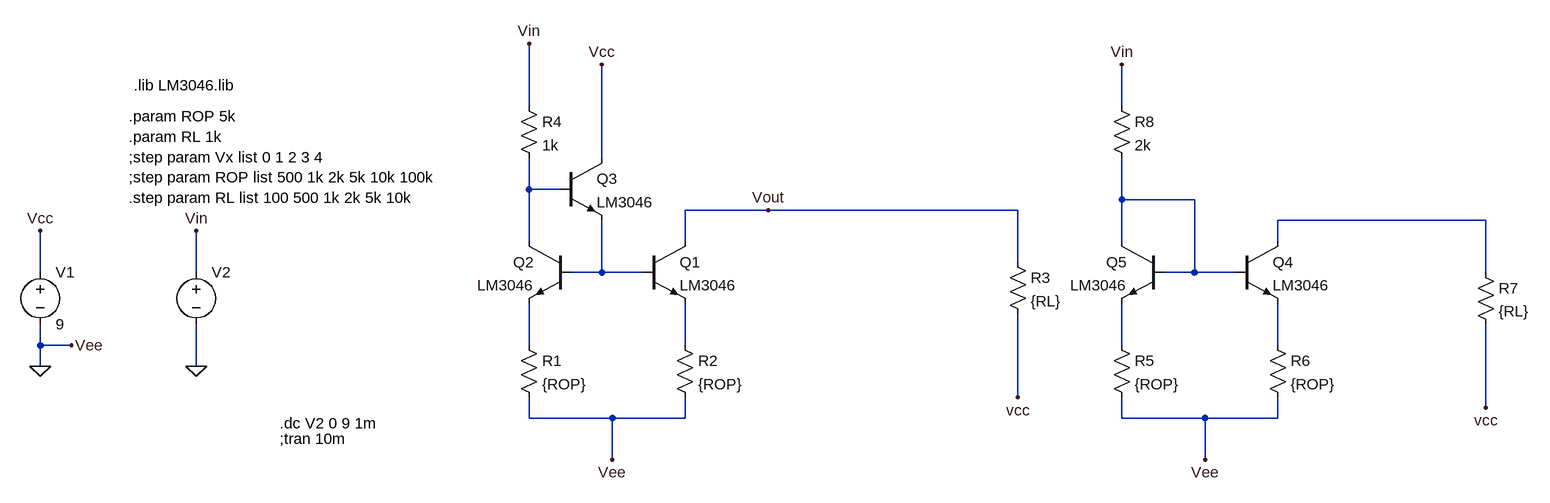
[diagram p0: schematic BJT_VoltageControlledCurrentSource1.asc]
BJT_VoltageControlledCurrentSource1.asc, the LTspice schematic file:
Version 4
SHEET 1 2172 680
WIRE 576 -288 576 -384
WIRE 1488 -288 1488 -352
WIRE 688 -208 688 -352
WIRE 576 -160 576 -208
WIRE 624 -160 576 -160
WIRE 1488 -144 1488 -208
WIRE 1600 -144 1488 -144
WIRE 944 -128 816 -128
WIRE 1328 -128 944 -128
WIRE 2048 -112 1728 -112
WIRE 576 -80 576 -160
WIRE 816 -80 816 -128
WIRE 1488 -80 1488 -144
WIRE 1728 -80 1728 -112
WIRE 1328 -48 1328 -128
WIRE -176 -32 -176 -96
WIRE 64 -32 64 -96
WIRE 688 -32 688 -112
WIRE 688 -32 640 -32
WIRE 752 -32 688 -32
WIRE 1600 -32 1600 -144
WIRE 1600 -32 1552 -32
WIRE 1664 -32 1600 -32
WIRE 2048 -32 2048 -112
WIRE -176 80 -176 48
WIRE -128 80 -176 80
WIRE 576 80 576 16
WIRE 816 80 816 16
WIRE 1488 80 1488 16
WIRE 1728 80 1728 16
WIRE -176 112 -176 80
WIRE 64 112 64 48
WIRE 1328 160 1328 32
WIRE 2048 176 2048 48
WIRE 576 192 576 160
WIRE 704 192 576 192
WIRE 816 192 816 160
WIRE 816 192 704 192
WIRE 1488 192 1488 160
WIRE 1616 192 1488 192
WIRE 1728 192 1728 160
WIRE 1728 192 1616 192
WIRE 704 256 704 192
WIRE 1616 256 1616 192
FLAG 688 -352 Vcc
FLAG 704 256 Vee
FLAG 576 -384 Vin
FLAG 944 -128 Vout
FLAG -176 112 0
FLAG 64 112 0
FLAG -176 -96 Vcc
FLAG 64 -96 Vin
FLAG -128 80 Vee
FLAG 1328 160 vcc
FLAG 1616 256 Vee
FLAG 2048 176 vcc
FLAG 1488 -352 Vin
SYMBOL npn 752 -80 R0
SYMATTR InstName Q1
SYMATTR Value LM3046
SYMBOL npn 640 -80 M0
SYMATTR InstName Q2
SYMATTR Value LM3046
SYMBOL npn 624 -208 R0
SYMATTR InstName Q3
SYMATTR Value LM3046
SYMBOL res 560 64 R0
SYMATTR InstName R1
SYMATTR Value {ROP}
SYMBOL res 800 64 R0
SYMATTR InstName R2
SYMATTR Value {ROP}
SYMBOL voltage -176 -48 R0
WINDOW 123 0 0 Left 2
WINDOW 39 0 0 Left 2
SYMATTR InstName V1
SYMATTR Value 9
SYMBOL voltage 64 -48 R0
WINDOW 123 0 0 Left 2
WINDOW 39 0 0 Left 2
SYMATTR InstName V2
SYMATTR Value ""
SYMBOL res 1312 -64 R0
SYMATTR InstName R3
SYMATTR Value {RL}
SYMBOL res 560 -304 R0
SYMATTR InstName R4
SYMATTR Value 1k
SYMBOL npn 1664 -80 R0
SYMATTR InstName Q4
SYMATTR Value LM3046
SYMBOL npn 1552 -80 M0
SYMATTR InstName Q5
SYMATTR Value LM3046
SYMBOL res 1472 64 R0
SYMATTR InstName R5
SYMATTR Value {ROP}
SYMBOL res 1712 64 R0
SYMATTR InstName R6
SYMATTR Value {ROP}
SYMBOL res 2032 -48 R0
SYMATTR InstName R7
SYMATTR Value {RL}
SYMBOL res 1472 -304 R0
SYMATTR InstName R8
SYMATTR Value 2k
TEXT -32 -320 Left 2 !.lib LM3046.lib
TEXT -40 -272 Left 2 !.param ROP 5k \n.param RL 1k\n;step param Vx list 0 1 2 3 4\n;step param ROP list 500 1k 2k 5k 10k 100k\n.step param RL list 100 500 1k 2k 5k 10k
TEXT 192 224 Left 2 !;tran 10m
TEXT 192 200 Left 2 !.dc V2 0 9 1m

The netlist it stands for:
* BJT_VoltageControlledCurrentSource1.asc
Q1 Vout N004 N006 0 LM3046
Q2 N001 N004 N005 0 LM3046
Q3 Vcc N001 N004 0 LM3046
R1 N005 0 {ROP}
R2 N006 0 {ROP}
V1 Vcc 0 9
V2 Vin 0
R3 Vout Vcc {RL}
R4 Vin N001 1k
Q4 N003 N002 N008 0 LM3046
Q5 N002 N002 N007 0 LM3046
R5 N007 0 {ROP}
R6 N008 0 {ROP}
R7 N003 Vcc {RL}
R8 Vin N002 2k
.model NPN NPN
.model PNP PNP
.lib standard.bjt
.lib LM3046.lib
.param ROP 5k
.param RL 1k
;step param Vx list 0 1 2 3 4
;step param ROP list 500 1k 2k 5k 10k 100k
.step param RL list 100 500 1k 2k 5k 10k
;tran 10m
.dc V2 0 9 1m
.backanno
.end